# Altium schematic sheet gydrodrive_discreteControl.SchDoc
size 297 x 209 mm; SheetNumber: 7; SheetTotal: 22
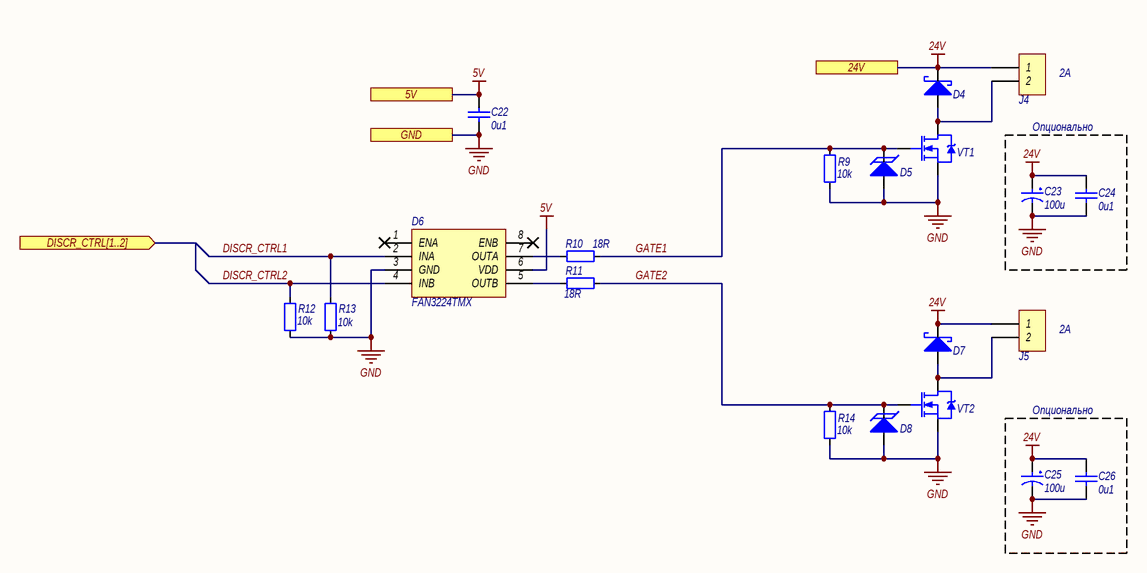
[diagram p0: gydrodrive_discreteControl.SchDoc]

## Parts
C22  Capacitance: 0u1  [CAPC2012-0805M]  (hidden comment: CAP_0805)
C23  Capacitance: 100u  [ECAP811.5]  (hidden comment: TKR101M1HF11)
C24  Capacitance: 0u1  [CAPC3216-1206M]  (hidden comment: CAP_1206)
C25  Capacitance: 100u  [ECAP811.5]  (hidden comment: TKR101M1HF11)
C26  Capacitance: 0u1  [CAPC3216-1206M]  (hidden comment: CAP_1206)
D4  SS24  [SMB_M]  (value not drawn)
D5  SMAJ12A  [SMA_M]  (value not drawn)
D6  FAN3224TMX  [SO8_M]
D7  SS24  [SMB_M]  (value not drawn)
D8  SMAJ12A  [SMA_M]  (value not drawn)
J4  DG142V-5.08-02P  [DG142V-5.08-02P]  (value not drawn)
J5  DG142V-5.08-02P  [DG142V-5.08-02P]  (value not drawn)
R9  Resistance: 10k  [RESC2012-0805M]  (hidden comment: RES_0805)
R10  Resistance: 18R  [RESC2012-0805M]  (hidden comment: RES_0805)
R11  Resistance: 18R  [RESC2012-0805M]  (hidden comment: RES_0805)
R12  Resistance: 10k  [RESC2012-0805M]  (hidden comment: RES_0805)
R13  Resistance: 10k  [RESC2012-0805M]  (hidden comment: RES_0805)
R14  Resistance: 10k  [RESC2012-0805M]  (hidden comment: RES_0805)
VT1  20N06  [TO-252AA_M]  (value not drawn)
VT2  20N06  [TO-252AA_M]  (value not drawn)

## Blocks framed on the sheet
Опционально: C23 C24
Опционально: C25 C26

## Ports
5V (see gydrodrive_main[1B], gydrodrive_can[4B], gydrodrive_currentSource[1C], gydrodrive_interfaces[3C], gydrodrive_supply[3B]), 24V (see gydrodrive_main[1A], gydrodrive_button[2B], gydrodrive_control[2B], gydrodrive_currentSource[1B], gydrodrive_encoder[3B], gydrodrive_linearPosSensor[2B], gydrodrive_sensor[2B], gydrodrive_sensors[1B], gydrodrive_sto[3B], gydrodrive_supply[2C]), DISCR_CTRL[1..2] (in, see gydrodrive_main[1B], gydrodrive_mcu[1B]), GND (see gydrodrive_main[1B], gydrodrive_button[2C], gydrodrive_can[3C], gydrodrive_control[2C], gydrodrive_currentSource[1B], gydrodrive_debugger[3C], gydrodrive_encoder[1B], gydrodrive_i2c[5C], gydrodrive_indication[3C], gydrodrive_inputTrim[2C], gydrodrive_interfaces[3A], gydrodrive_linearPosSensor[2C], gydrodrive_mcu[6D], gydrodrive_reservedPins[2C], gydrodrive_rs485[3B], gydrodrive_sensor[2C], gydrodrive_sensors[1B], gydrodrive_sto[2C], gydrodrive_supply[2C], gydrodrive_uart[4C])

## Nets
5V: C22.2 D6.6(VDD) ; port 5V
24V: C23.1 C24.2 C25.1 C26.2 D4.1(K) D7.1(K) J4.1 J5.1 ; port 24V
GND: C22.1 C23.2 C24.1 C25.2 C26.1 D5.2(A) D6.3(GND) D8.2(A) R9.1 R12.1 R13.1 R14.1 VT1.3(S) VT2.3(S) ; port GND
DISCR_CTRL1: D6.2(INA) R13.2
DISCR_CTRL2: D6.4(INB) R12.2
GATE1: D5.1(K) R9.2 R10.1 VT1.1(G)
GATE2: D8.1(K) R11.1 R14.2 VT2.1(G)
NetD4_2: D4.2(A) J4.2 VT1.2(D)
NetD6_5: D6.5(OUTB) R11.2
NetD6_7: D6.7(OUTA) R10.2
NetD7_2: D7.2(A) J5.2 VT2.2(D)

Not connected (* = marked no-connect by the designer): D6 1(ENA)* 8(ENB)*

## Notes on the sheet
- (near J4) 2А
- (near J5) 2А
- Подп. и дата
- Инв. № дубл.
- Взам. инв. №
- Инв. № подл.
- Изм.
- Лист
- № докум.
- Подп.
- Дата
- Копировал
- Формат
- A4

## Library data of the parts
C22 = CAPC_0805: Конденсатор керамический, корпус 0805; Parameters: 0u1,  50V; Voltage: 50V; Max Price: 5; Part Number: CAPC_0805; Part Name: ='Конд-р керам. 0805,  '  + Parameters; Component Type: Standart; Pin Count: 2
C23 C25 = TKR101M1HF11: Конденсатор электролитический; Part Name: Конд-р электрол.  TKR101M1HF11, 100uF, 50V; Parameters: 100uF, 50V; Voltage: 50V; Max Price: 20; Part Number: TKR101M1HF11; Component Type: Standart
C24 C26 = CAPC_1206: Конденсатор керамический, корпус 1206; Parameters: 0u1,  50V; Voltage: 50V; Max Price: 12; Part Number: CAPC_1206; Part Name: ='Конд-р керам. 1206,  '  + Parameters; Component Type: Standart; Pin Count: 2
D4 D7 = SS24: Диод Шоттки; Part Name: Диод Шоттки SS24; Parameters: 40V, 2A; Voltage: 40V; Current: 2A; Max Price: 15; Part Number: SS24; Component Type: Standart; Pin Count: 2
D5 D8 = SMAJ12A: Защитный диод (TVS); Part Name: Защитный диод SMAJ12A; Parameters: 12V, 400W; Voltage: 12V; Max Price: 40; Power: 400W; Part Number: SMAJ12A; Component Type: Standart; Pin Count: 2
D6 = FAN3224TMX: Сдвоенный драйвер ключей нижнего уровня; Part Name: MOSFET драйвер FAN3224TMX; Parameters: 4.5..18V, 5A, LL; Configuration: LL; Supply Voltage: 4.5..18V; Current: 5A; Max Price: 300; Part Number: FAN3224TMX; Component Type: Standart
J4 J5 = DG142V-5.08-02P: Клеммник 2-контактный, шаг 5.08 мм; Part Name: Клеммник DG142V-5.08-02P; Parameters: 8А; Max Price: 60; System: Connector; Part Number: DG142V-5.08-02P; Component Type: Standart; Pin Count: 2
R9 R12-R14 = RESC_0805: Рез-р, корпус 0805; Tolerance: 5%; Parameters: 10k, 5%; Max Price: 3; Part Number: RESC_0805; Part Name: ='Рез-р 0805, ' + Parameters; Component Type: Standart
R10 R11 = RESC_0805: Рез-р, корпус 0805; Tolerance: 5%; Parameters: 18R, 5%; Max Price: 3; Part Number: RESC_0805; Part Name: ='Рез-р 0805, ' + Parameters; Component Type: Standart
VT1 VT2 = 20N06: Полевой транзистор; Part Name: Транзистора 20N06; Parameters: 60V, 20A; Voltage: 60V; Current: 20A; Max Price: 20; Part Number: 20N06; Component Type: Standart